# EAGLE design uSD_extender_male (EAGLE 9.4.2)
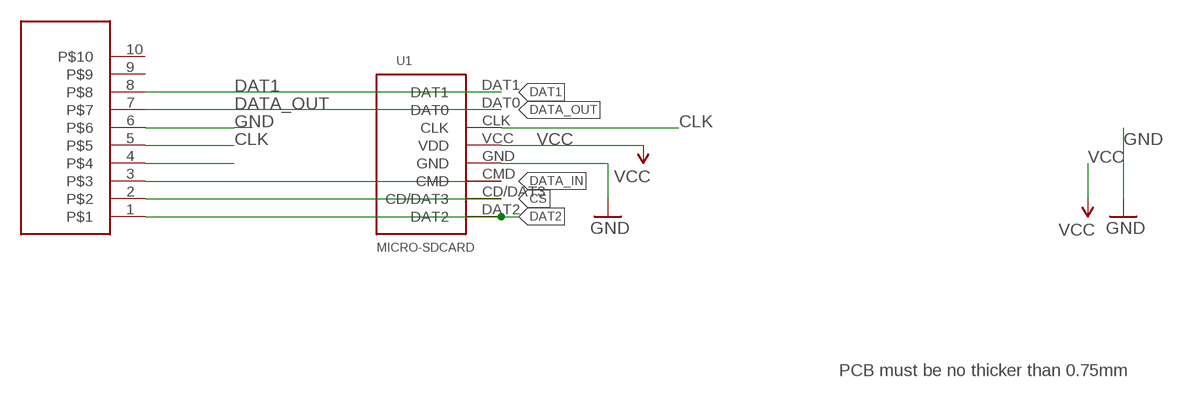
[diagram p0: schematic, sheet 1]

## Parts
U1  MICRO-SDCARD  [MICRO-SDCARD]
U$2  1734592-8  [TE_1-1734592-8]

## Nets
CLK: U1.CLK U$2.5
CS: U1.CD/DAT3 U$2.2
DAT1: U1.DAT1 U$2.8
DAT2: U1.DAT2 U$2.1
DATA_IN: U1.CMD U$2.3
DATA_OUT: U1.DAT0 U$2.7
GND: U1.GND U$2.6
VCC: U1.VCC(VDD) U$2.4
Unconnected: U$2.9 U$2.10

## Notes on the sheet
- PCB must be no thicker than 0.75mm

## Library data of the parts
U1 = SparkFun-Boards:MICRO-SDCARD: MicroSD footprint- NOT a socket for a MicroSD card!
U$2 = TE - 1-1734592-0:1734592-8

## Board
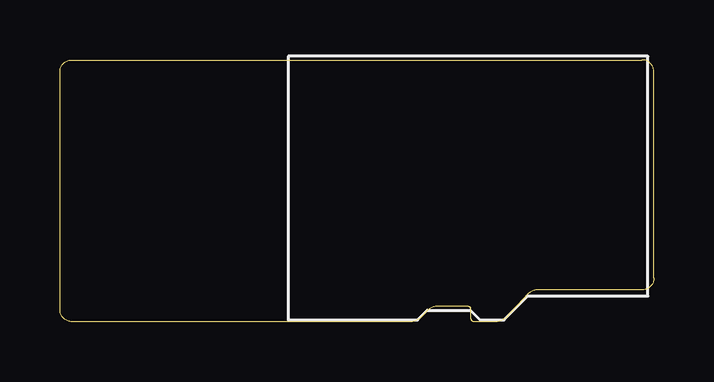
[diagram p1: board, top side]
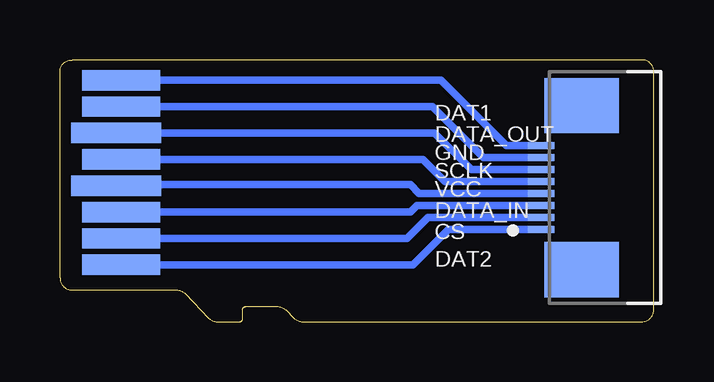
[diagram p2: board, bottom side, seen from below]

Size 24.77 x 10.92 mm. Coordinates in mm from the lower left corner, seen from the top.
Outline: 14.65,0 0.5,0 arc-90 0,0.5 0,10.42 arc-90 0.5,10.92 24.26,10.92 arc-90 24.77,10.41 24.77,1.83 arc-90 24.26,1.32 19.89,1.32 arc45 19.54,1.17 18.56,0.15 arc-45 18.2,0 17.27,0 arc-90 17.14,0.13 17.14,0.51 arc90 17.02,0.64 15.7,0.64 arc45 15.35,0.49 15.01,0.15 arc-45 14.65,0
Copper layers (1*16): Top 0.018mm / dielectric 1.55mm / Bottom 0.018mm
Design rules "eC_2Layer_PClass6_BaseCopperO18_eCDefault": minimum track width 0.15mm, minimum drill 0.35mm, track to track 0.15mm, track to pad 0.15mm, pad to pad 0.15mm, via to via 0.15mm, smd to smd 0mil, copper to edge 0.25mm, drill to drill 0.35mm, minimum pad ring 0.175mm, minimum via ring 0.125mm, stop-mask expansion 0mil, vias tented up to drill 0.45mm, thermal gap 0.2mm

### Footprints (pad centres in the part's own frame; a part is rotated, then mirrored left to right if it is on the bottom)
MICRO-SDCARD = smd 0.85 x 3.25 bottom: CD/DAT3 2.56,2.3; CLK 5.86,2.3; CMD 3.66,2.3; DAT0 8.06,2.3; DAT1 9.16,2.3; DAT2 1.46,2.3 | smd 0.85 x 3.75 bottom: GND 6.96,2.1; VCC 4.76,2.1
TE_1-1734592-8 = smd 0.3 x 1.1: 1 -2.25,2.55; 2 -1.75,2.55; 3 -1.25,2.55; 4 -0.75,2.55; 5 -0.25,2.55; 6 0.25,2.55; 7 0.75,2.55; 8 1.25,2.55 | smd 2.3 x 3.1: 9 -3.92,0.85; 10 2.92,0.85

### Placement (x,y rotation side)
U1  24.51,0.91 90 top
U$2  2.16,6.1 90 bottom

### Tracks (layer width: path | path; a pad name or v marks a point on that pad's centre or on a via)
CLK
  Bottom 0.305: U$2.5 8.7,5.85 9.63,6.77 U1.CLK
CS
  Bottom 0.305: U$2.2 9.43,4.35 10.3,3.47 U1.CD/DAT3
DAT1
  Bottom 0.305: U1.DAT1 8.88,10.07 6.16,7.35 U$2.8
DAT2
  Bottom 0.305: U$2.1 8.57,3.85 8.91,3.51 10.04,2.37 10.16,2.37 U1.DAT2
DATA_IN
  Bottom 0.305: U$2.3 9.89,4.85 10.16,4.57 U1.CMD
DATA_OUT
  Bottom 0.305: U$2.7 7.1,6.85 9.23,8.97 U1.DAT0
GND
  Bottom 0.305: U$2.6 7.62,6.35 9.14,7.87 U1.GND
VCC
  Bottom 0.305: U$2.4 9.79,5.35 10.16,5.71 21.59,5.71 21.63,5.67 U1.VCC

### Text on the board
bNames: DAT1 | DATA_OUT | GND | SCLK | VCC | DATA_IN | CS | DAT2